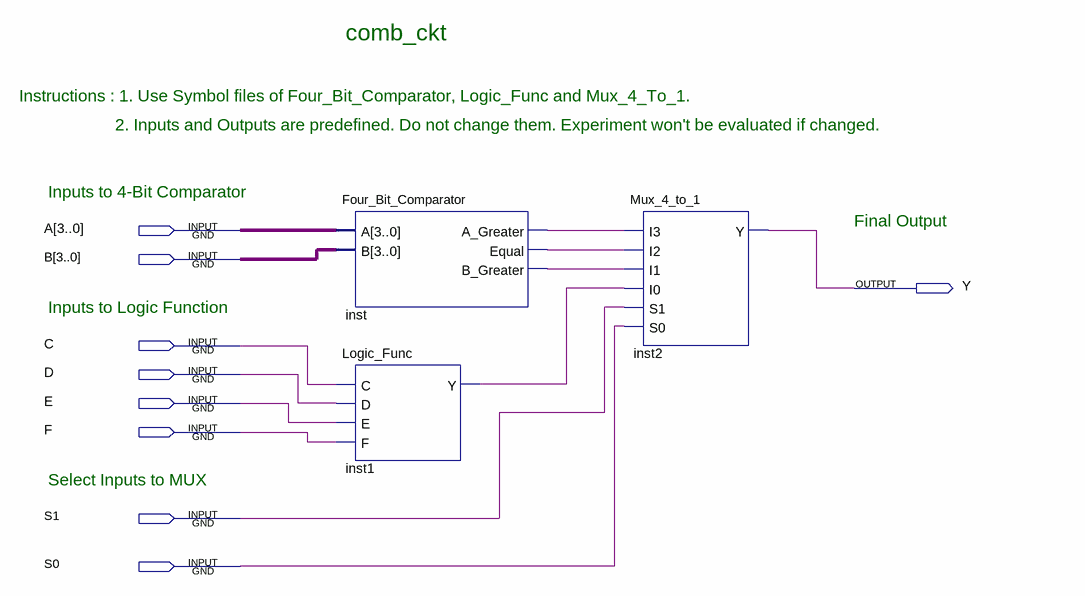
[diagram p0: schematic sheet]
// Quartus schematic comb_ckt.bdf as structural Verilog: 3 symbols, 9 pins
module comb_ckt (
  input  [3:0] A,
  input  [3:0] B,
  input  C,
  input  D,
  input  E,
  input  F,
  input  S1,
  input  S0,
  output Y
);

  wire inst1_y, inst_a_greater, inst_b_greater, inst_equal;

  Four_Bit_Comparator inst (.A(A), .B(B), .A_Greater(inst_a_greater), .Equal(inst_equal), .B_Greater(inst_b_greater));
  Logic_Func inst1 (.C(C), .D(D), .E(E), .F(F), .Y(inst1_y));
  Mux_4_to_1 inst2 (.I3(inst_a_greater), .I2(inst_equal), .I1(inst_b_greater), .I0(inst1_y), .S1(S1), .S0(S0), .Y(Y));

  // Notes on the sheet:
  //   comb_ckt
  //   Instructions : 1. Use Symbol files of Four_Bit_Comparator, Logic_Func and Mux_4_To_1. 
  //   2. Inputs and Outputs are predefined. Do not change them. Experiment won't be evaluated if changed.
  //   Inputs to 4-Bit Comparator
  //   Final Output
  //   Inputs to Logic Function
  //   Select Inputs to MUX
endmodule
